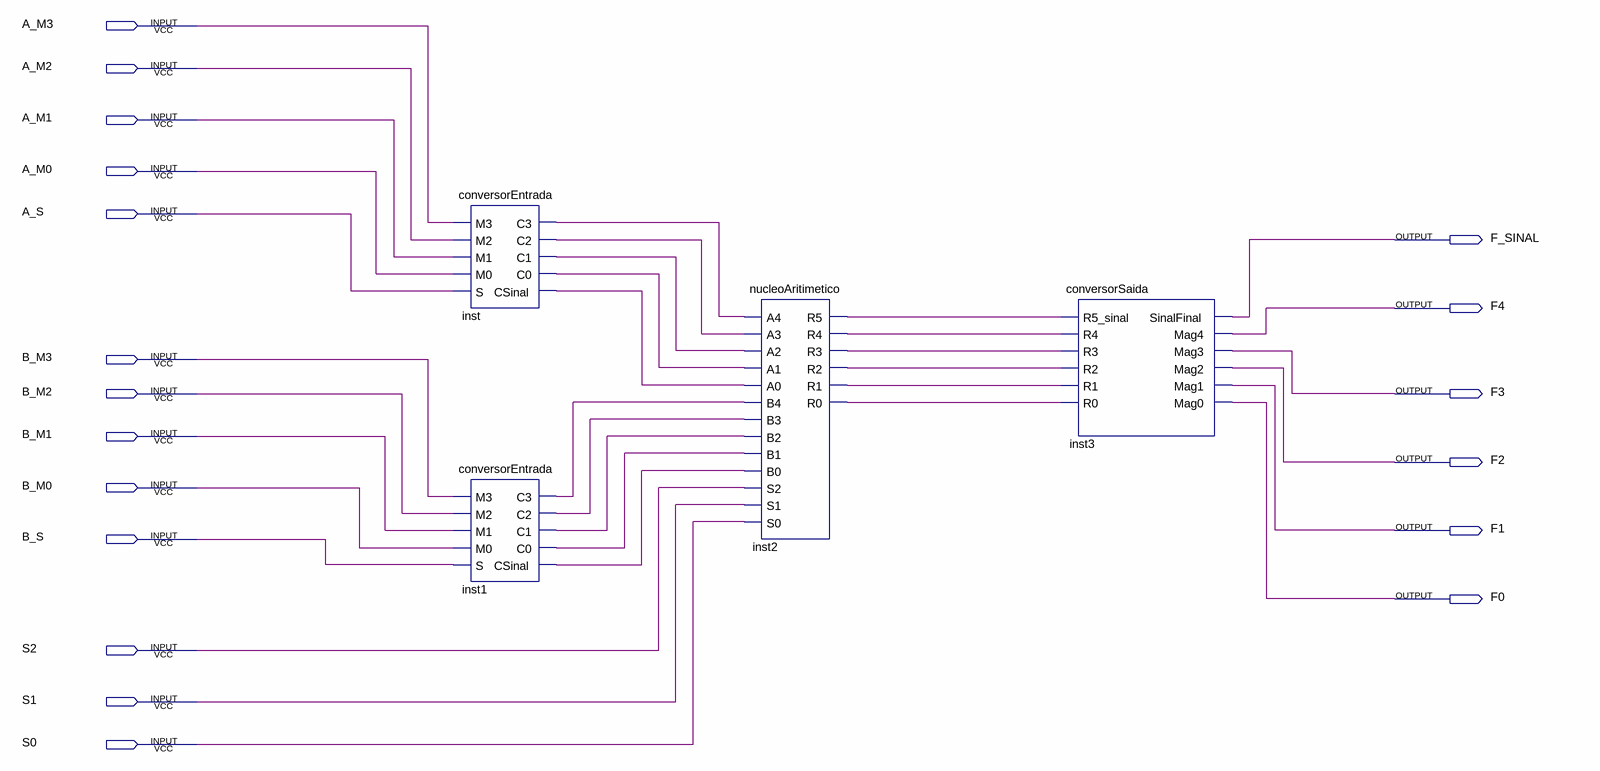
[diagram p0: schematic sheet]
// Quartus schematic UnidadeAritimetica.bdf as structural Verilog: 4 symbols, 19 pins
module UnidadeAritimetica (
  input  A_M3,
  input  A_M2,
  input  A_M1,
  input  A_M0,
  input  A_S,
  input  B_M3,
  input  B_M2,
  input  B_M1,
  input  B_M0,
  input  B_S,
  input  S2,
  input  S1,
  input  S0,
  output F_SINAL,
  output F4,
  output F3,
  output F2,
  output F1,
  output F0
);

  wire inst1_c0, inst1_c1, inst1_c2, inst1_c3, inst1_csinal, inst2_r0, inst2_r1, inst2_r2, inst2_r3,
       inst2_r4, inst2_r5, inst_c0, inst_c1, inst_c2, inst_c3, inst_csinal;

  conversorEntrada inst (
    .M3(A_M3), .M2(A_M2), .M1(A_M1), .M0(A_M0), .S(A_S), .C3(inst_c3), .C2(inst_c2), .C1(inst_c1),
    .C0(inst_c0), .CSinal(inst_csinal));
  conversorEntrada inst1 (
    .M3(B_M3), .M2(B_M2), .M1(B_M1), .M0(B_M0), .S(B_S), .C3(inst1_c3), .C2(inst1_c2), .C1(inst1_c1),
    .C0(inst1_c0), .CSinal(inst1_csinal));
  nucleoAritimetico inst2 (
    .A4(inst_c3), .A3(inst_c2), .A2(inst_c1), .A1(inst_c0), .A0(inst_csinal), .B4(inst1_c3), .B3(inst1_c2),
    .B2(inst1_c1), .B1(inst1_c0), .B0(inst1_csinal), .S2(S2), .S1(S1), .S0(S0), .R5(inst2_r5), .R4(inst2_r4),
    .R3(inst2_r3), .R2(inst2_r2), .R1(inst2_r1), .R0(inst2_r0));
  conversorSaida inst3 (
    .R5_sinal(inst2_r5), .R4(inst2_r4), .R3(inst2_r3), .R2(inst2_r2), .R1(inst2_r1), .R0(inst2_r0),
    .SinalFinal(F_SINAL), .Mag4(F4), .Mag3(F3), .Mag2(F2), .Mag1(F1), .Mag0(F0));
endmodule
